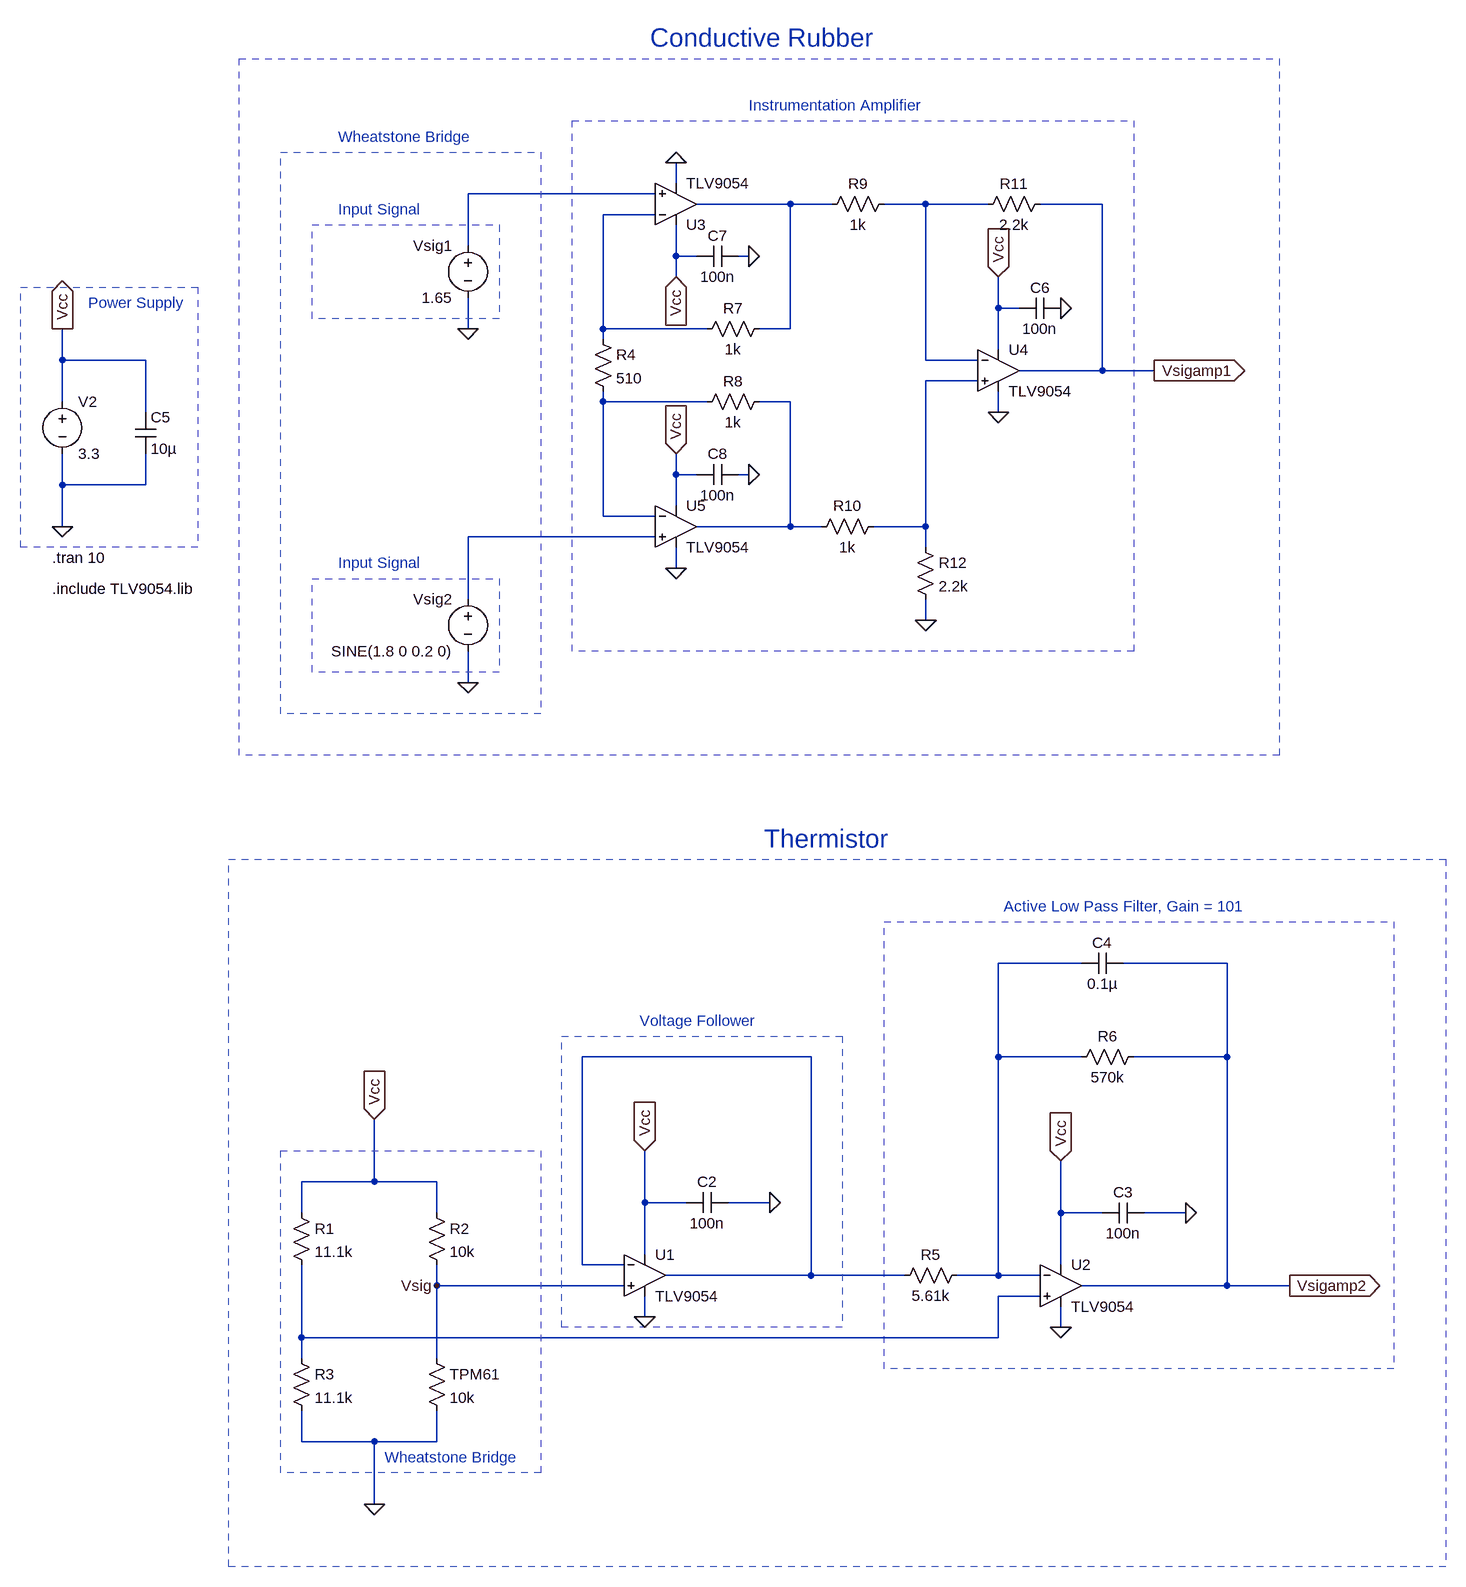
[diagram p0: schematic Project3.asc]
Project3.asc, the LTspice schematic file:
Version 4.1
SHEET 1 1760 856
WIRE -208 -1376 -208 -1408
WIRE -240 -1360 -528 -1360
WIRE -32 -1344 -176 -1344
WIRE 32 -1344 -32 -1344
WIRE 176 -1344 112 -1344
WIRE 272 -1344 176 -1344
WIRE 448 -1344 352 -1344
WIRE -240 -1328 -320 -1328
WIRE -528 -1280 -528 -1360
WIRE -208 -1264 -208 -1312
WIRE -176 -1264 -208 -1264
WIRE -96 -1264 -112 -1264
WIRE -208 -1232 -208 -1264
WIRE 288 -1184 288 -1232
WIRE 320 -1184 288 -1184
WIRE -528 -1152 -528 -1200
WIRE -320 -1152 -320 -1328
WIRE -160 -1152 -320 -1152
WIRE -32 -1152 -32 -1344
WIRE -32 -1152 -80 -1152
WIRE -320 -1136 -320 -1152
WIRE 288 -1120 288 -1184
WIRE -1152 -1104 -1152 -1152
WIRE -1024 -1104 -1152 -1104
WIRE 176 -1104 176 -1344
WIRE 256 -1104 176 -1104
WIRE 448 -1088 448 -1344
WIRE 448 -1088 320 -1088
WIRE 528 -1088 448 -1088
WIRE 256 -1072 176 -1072
WIRE -1152 -1040 -1152 -1104
WIRE -320 -1040 -320 -1056
WIRE -160 -1040 -320 -1040
WIRE -32 -1040 -80 -1040
WIRE -1024 -1024 -1024 -1104
WIRE 288 -1024 288 -1056
WIRE -208 -928 -208 -960
WIRE -176 -928 -208 -928
WIRE -96 -928 -112 -928
WIRE -1152 -912 -1152 -960
WIRE -1024 -912 -1024 -960
WIRE -1024 -912 -1152 -912
WIRE -208 -880 -208 -928
WIRE -320 -864 -320 -1040
WIRE -240 -864 -320 -864
WIRE -1152 -848 -1152 -912
WIRE -32 -848 -32 -1040
WIRE -32 -848 -176 -848
WIRE 16 -848 -32 -848
WIRE 176 -848 176 -1072
WIRE 176 -848 96 -848
WIRE -240 -832 -528 -832
WIRE 176 -816 176 -848
WIRE -208 -784 -208 -816
WIRE -528 -736 -528 -832
WIRE 176 -704 176 -736
WIRE -528 -608 -528 -656
WIRE 416 -176 288 -176
WIRE 640 -176 480 -176
WIRE 0 -32 -352 -32
WIRE 288 -32 288 -176
WIRE 416 -32 288 -32
WIRE 640 -32 640 -176
WIRE 640 -32 496 -32
WIRE -672 160 -672 64
WIRE -672 160 -784 160
WIRE -576 160 -672 160
WIRE -256 192 -256 112
WIRE -192 192 -256 192
WIRE -64 192 -128 192
WIRE -784 208 -784 160
WIRE -576 208 -576 160
WIRE 384 208 384 128
WIRE 448 208 384 208
WIRE 576 208 512 208
WIRE -256 272 -256 192
WIRE -352 288 -352 -32
WIRE -288 288 -352 288
WIRE 384 288 384 208
WIRE 0 304 0 -32
WIRE 0 304 -224 304
WIRE 144 304 0 304
WIRE 288 304 288 -32
WIRE 288 304 224 304
WIRE 352 304 288 304
WIRE -576 320 -576 288
WIRE -288 320 -576 320
WIRE 640 320 640 -32
WIRE 640 320 416 320
WIRE 736 320 640 320
WIRE 352 336 288 336
WIRE -256 368 -256 336
WIRE 384 384 384 352
WIRE -784 400 -784 288
WIRE 288 400 288 336
WIRE 288 400 -784 400
WIRE -784 432 -784 400
WIRE -576 432 -576 320
WIRE -784 560 -784 512
WIRE -672 560 -784 560
WIRE -576 560 -576 512
WIRE -576 560 -672 560
WIRE -672 656 -672 560
FLAG -672 64 Vcc
IOPIN -672 64 In
FLAG -64 192 0
FLAG -256 112 Vcc
IOPIN -256 112 In
FLAG -256 368 0
FLAG 576 208 0
FLAG 384 128 Vcc
IOPIN 384 128 In
FLAG 384 384 0
FLAG 736 320 Vsigamp2
IOPIN 736 320 Out
FLAG -576 320 Vsig
FLAG -1152 -848 0
FLAG -1152 -1152 Vcc
IOPIN -1152 -1152 Out
FLAG -208 -1232 Vcc
IOPIN -208 -1232 In
FLAG -208 -1408 0
FLAG 288 -1232 Vcc
IOPIN 288 -1232 In
FLAG -528 -1152 0
FLAG 528 -1088 Vsigamp1
IOPIN 528 -1088 Out
FLAG 384 -1184 0
FLAG -96 -1264 0
FLAG 288 -1024 0
FLAG -208 -960 Vcc
IOPIN -208 -960 In
FLAG -208 -784 0
FLAG -96 -928 0
FLAG -528 -608 0
FLAG 176 -704 0
FLAG -672 656 0
SYMBOL res -800 192 R0
SYMATTR InstName R1
SYMATTR Value 11.1k
SYMBOL res -592 192 R0
SYMATTR InstName R2
SYMATTR Value 10k
SYMBOL res -800 416 R0
SYMATTR InstName R3
SYMATTR Value 11.1k
SYMBOL res -592 416 R0
SYMATTR InstName TPM61
SYMATTR Value 10k
SYMBOL TLV9054 -256 304 R0
SYMATTR InstName U1
SYMBOL cap -128 176 R90
WINDOW 0 0 32 VBottom 2
WINDOW 3 32 32 VTop 2
SYMATTR InstName C2
SYMATTR Value 100n
SYMBOL res 240 288 R90
WINDOW 0 0 56 VBottom 2
WINDOW 3 32 56 VTop 2
SYMATTR InstName R5
SYMATTR Value 5.61k
SYMBOL TLV9054 384 320 R0
SYMATTR InstName U2
SYMBOL cap 512 192 R90
WINDOW 0 0 32 VBottom 2
WINDOW 3 32 32 VTop 2
SYMATTR InstName C3
SYMATTR Value 100n
SYMBOL res 512 -48 R90
WINDOW 0 0 56 VBottom 2
WINDOW 3 32 56 VTop 2
SYMATTR InstName R6
SYMATTR Value 570k
SYMBOL cap 480 -192 R90
WINDOW 0 0 32 VBottom 2
WINDOW 3 32 32 VTop 2
SYMATTR InstName C4
SYMATTR Value 0.1µ
SYMBOL voltage -1152 -1056 R0
WINDOW 123 0 0 Left 0
WINDOW 39 0 0 Left 0
SYMATTR InstName V2
SYMATTR Value 3.3
SYMBOL cap -1040 -1024 R0
SYMATTR InstName C5
SYMATTR Value 10µ
SYMBOL voltage -528 -1296 M0
WINDOW 123 0 0 Left 0
WINDOW 39 0 0 Left 0
SYMATTR InstName Vsig1
SYMATTR Value 1.65
SYMBOL TLV9054 -208 -1344 M180
SYMATTR InstName U3
SYMBOL TLV9054 288 -1088 R0
SYMATTR InstName U4
SYMBOL cap 384 -1200 R90
WINDOW 0 0 32 VBottom 2
WINDOW 3 32 32 VTop 2
SYMATTR InstName C6
SYMATTR Value 100n
SYMBOL cap -112 -1248 M270
WINDOW 0 32 32 VTop 2
WINDOW 3 0 32 VBottom 2
SYMATTR InstName C7
SYMATTR Value 100n
SYMBOL TLV9054 -208 -848 R0
SYMATTR InstName U5
SYMBOL cap -112 -944 R90
WINDOW 0 0 32 VBottom 2
WINDOW 3 32 32 VTop 2
SYMATTR InstName C8
SYMATTR Value 100n
SYMBOL voltage -528 -752 M0
WINDOW 123 0 0 Left 0
WINDOW 39 0 0 Left 0
SYMATTR InstName Vsig2
SYMATTR Value SINE(1.8 0 0.2 0)
SYMBOL res -336 -1152 R0
SYMATTR InstName R4
SYMATTR Value 510
SYMBOL res -64 -1168 R90
WINDOW 0 0 56 VBottom 2
WINDOW 3 32 56 VTop 2
SYMATTR InstName R7
SYMATTR Value 1k
SYMBOL res -64 -1056 R90
WINDOW 0 0 56 VBottom 2
WINDOW 3 32 56 VTop 2
SYMATTR InstName R8
SYMATTR Value 1k
SYMBOL res 128 -1360 R90
WINDOW 0 0 56 VBottom 2
WINDOW 3 32 56 VTop 2
SYMATTR InstName R9
SYMATTR Value 1k
SYMBOL res 112 -864 R90
WINDOW 0 0 56 VBottom 2
WINDOW 3 32 56 VTop 2
SYMATTR InstName R10
SYMATTR Value 1k
SYMBOL res 368 -1360 R90
WINDOW 0 0 56 VBottom 2
WINDOW 3 32 56 VTop 2
SYMATTR InstName R11
SYMATTR Value 2.2k
SYMBOL res 160 -832 R0
SYMATTR InstName R12
SYMATTR Value 2.2k
TEXT -1168 -752 Left 2 !.include TLV9054.lib
TEXT -656 584 Left 2 ;Wheatstone Bridge
TEXT -264 -88 Left 2 ;Voltage Follower
TEXT 296 -264 Left 2 ;Active Low Pass Filter, Gain = 101
TEXT -1168 -800 Left 2 !.tran 10
TEXT -728 -1336 Left 2 ;Input Signal
TEXT -1112 -1192 Left 2 ;Power Supply
TEXT -728 -792 Left 2 ;Input Signal
TEXT -96 -1496 Left 2 ;Instrumentation Amplifier
TEXT -728 -1448 Left 2 ;Wheatstone Bridge
TEXT -72 -368 Left 4 ;Thermistor
TEXT -248 -1600 Left 4 ;Conductive Rubber
RECTANGLE Normal 48 384 -384 -64 3
RECTANGLE Normal -416 608 -816 112 3
RECTANGLE Normal -480 -1168 -768 -1312 3
RECTANGLE Normal -944 -816 -1216 -1216 3
RECTANGLE Normal -480 -624 -768 -768 3
RECTANGLE Normal 496 -656 -368 -1472 3
RECTANGLE Normal -416 -560 -816 -1424 3
RECTANGLE Normal 896 448 112 -240 3
RECTANGLE Normal 720 -496 -880 -1568 3
RECTANGLE Normal 976 752 -896 -336 3

The netlist it stands for:
* Project3.asc
R1 Vcc N011 11.1k
R2 Vcc Vsig 10k
R3 N011 0 11.1k
R§TPM61 Vsig 0 10k
* U1: TLV9054 (symbol TLV9054 not available, pins judged from their places): In+=Vsig In-=N010 V+=Vcc V-=0 OUT=N010
C2 0 Vcc 100n
R5 N009 N010 5.61k
* U2: TLV9054 (symbol TLV9054 not available, pins judged from their places): In+=N011 In-=N009 V+=Vcc V-=0 OUT=Vsigamp2
C3 0 Vcc 100n
R6 Vsigamp2 N009 570k
C4 Vsigamp2 N009 0.1µ
V2 Vcc 0 3.3
C5 Vcc 0 10µ
Vsig1 N001 0 1.65
* U3: TLV9054 (symbol TLV9054 not available, pins judged from their places): In+=N001 In-=N004 V+=Vcc V-=0 OUT=N002
* U4: TLV9054 (symbol TLV9054 not available, pins judged from their places): In+=N005 In-=N003 V+=Vcc V-=0 OUT=Vsigamp1
C6 0 Vcc 100n
C7 0 Vcc 100n
* U5: TLV9054 (symbol TLV9054 not available, pins judged from their places): In+=N008 In-=N006 V+=Vcc V-=0 OUT=N007
C8 0 Vcc 100n
Vsig2 N008 0 SINE(1.8 0 0.2 0)
R4 N004 N006 510
R7 N002 N004 1k
R8 N007 N006 1k
R9 N003 N002 1k
R10 N005 N007 1k
R11 Vsigamp1 N003 2.2k
R12 N005 0 2.2k
.include TLV9054.lib
* Wheatstone Bridge
* Voltage Follower
* Active Low Pass Filter, Gain = 101
.tran 10
* Input Signal
* Power Supply
* Input Signal
* Instrumentation Amplifier
* Wheatstone Bridge
* Thermistor
* Conductive Rubber
.backanno
.end